# Altium schematic sheet Cap_Sensor_8x8.SchDoc
size A2
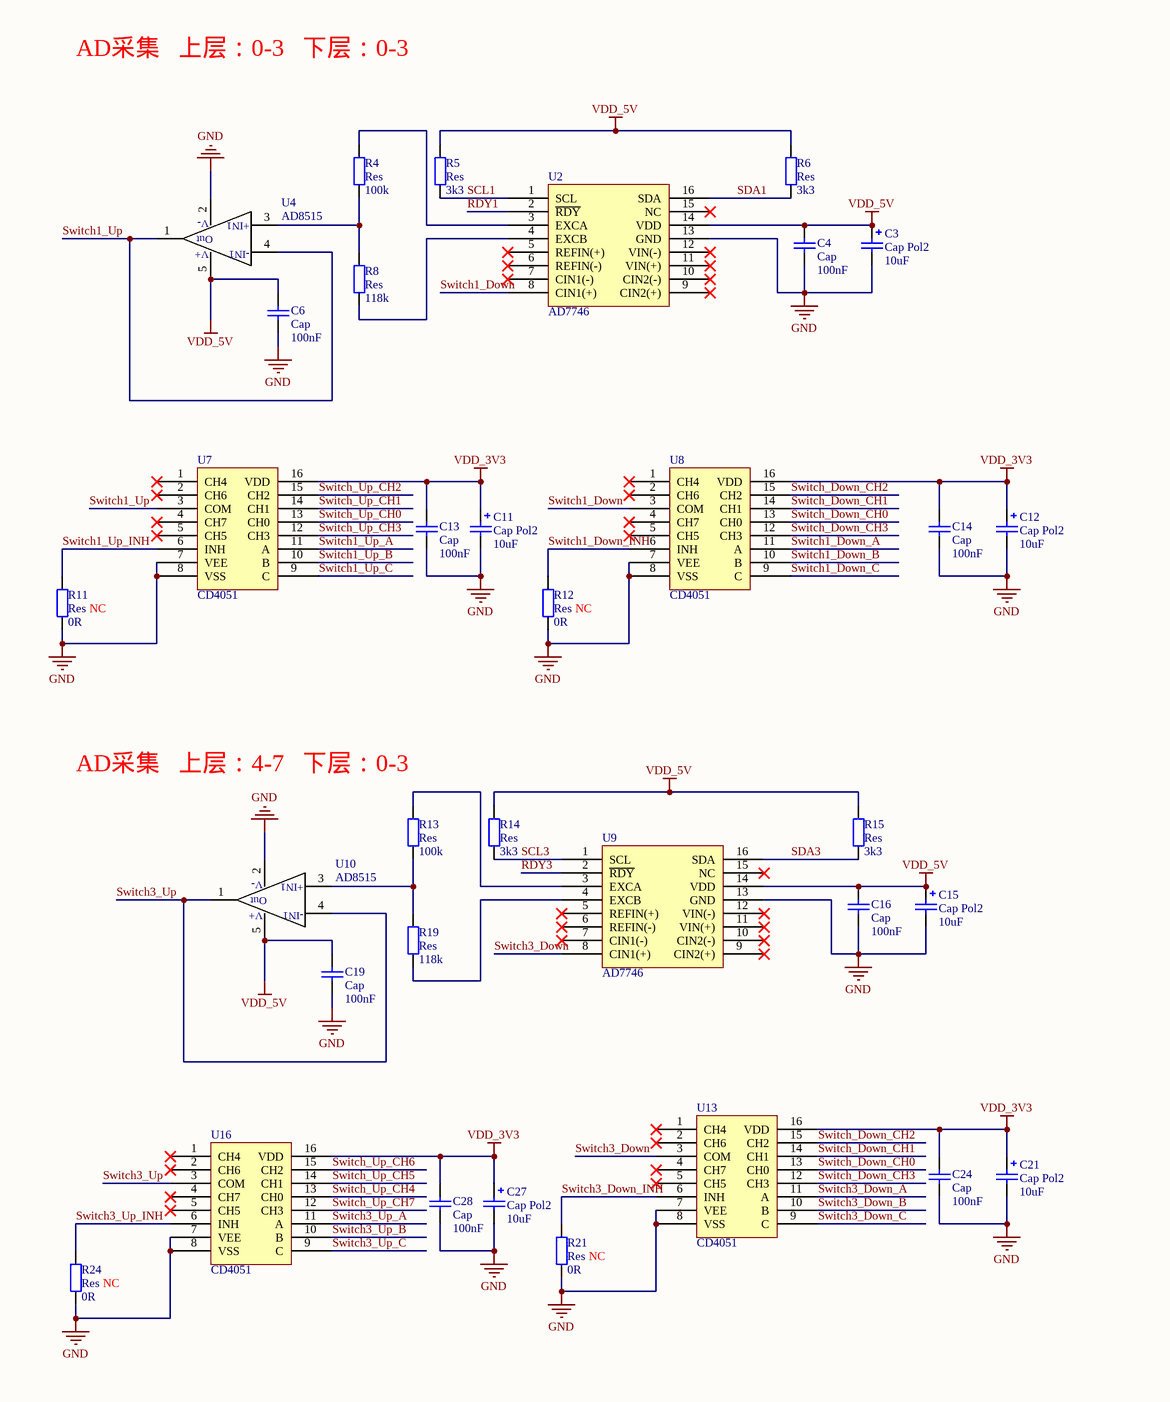
[diagram p0: Cap_Sensor_8x8.SchDoc, left]
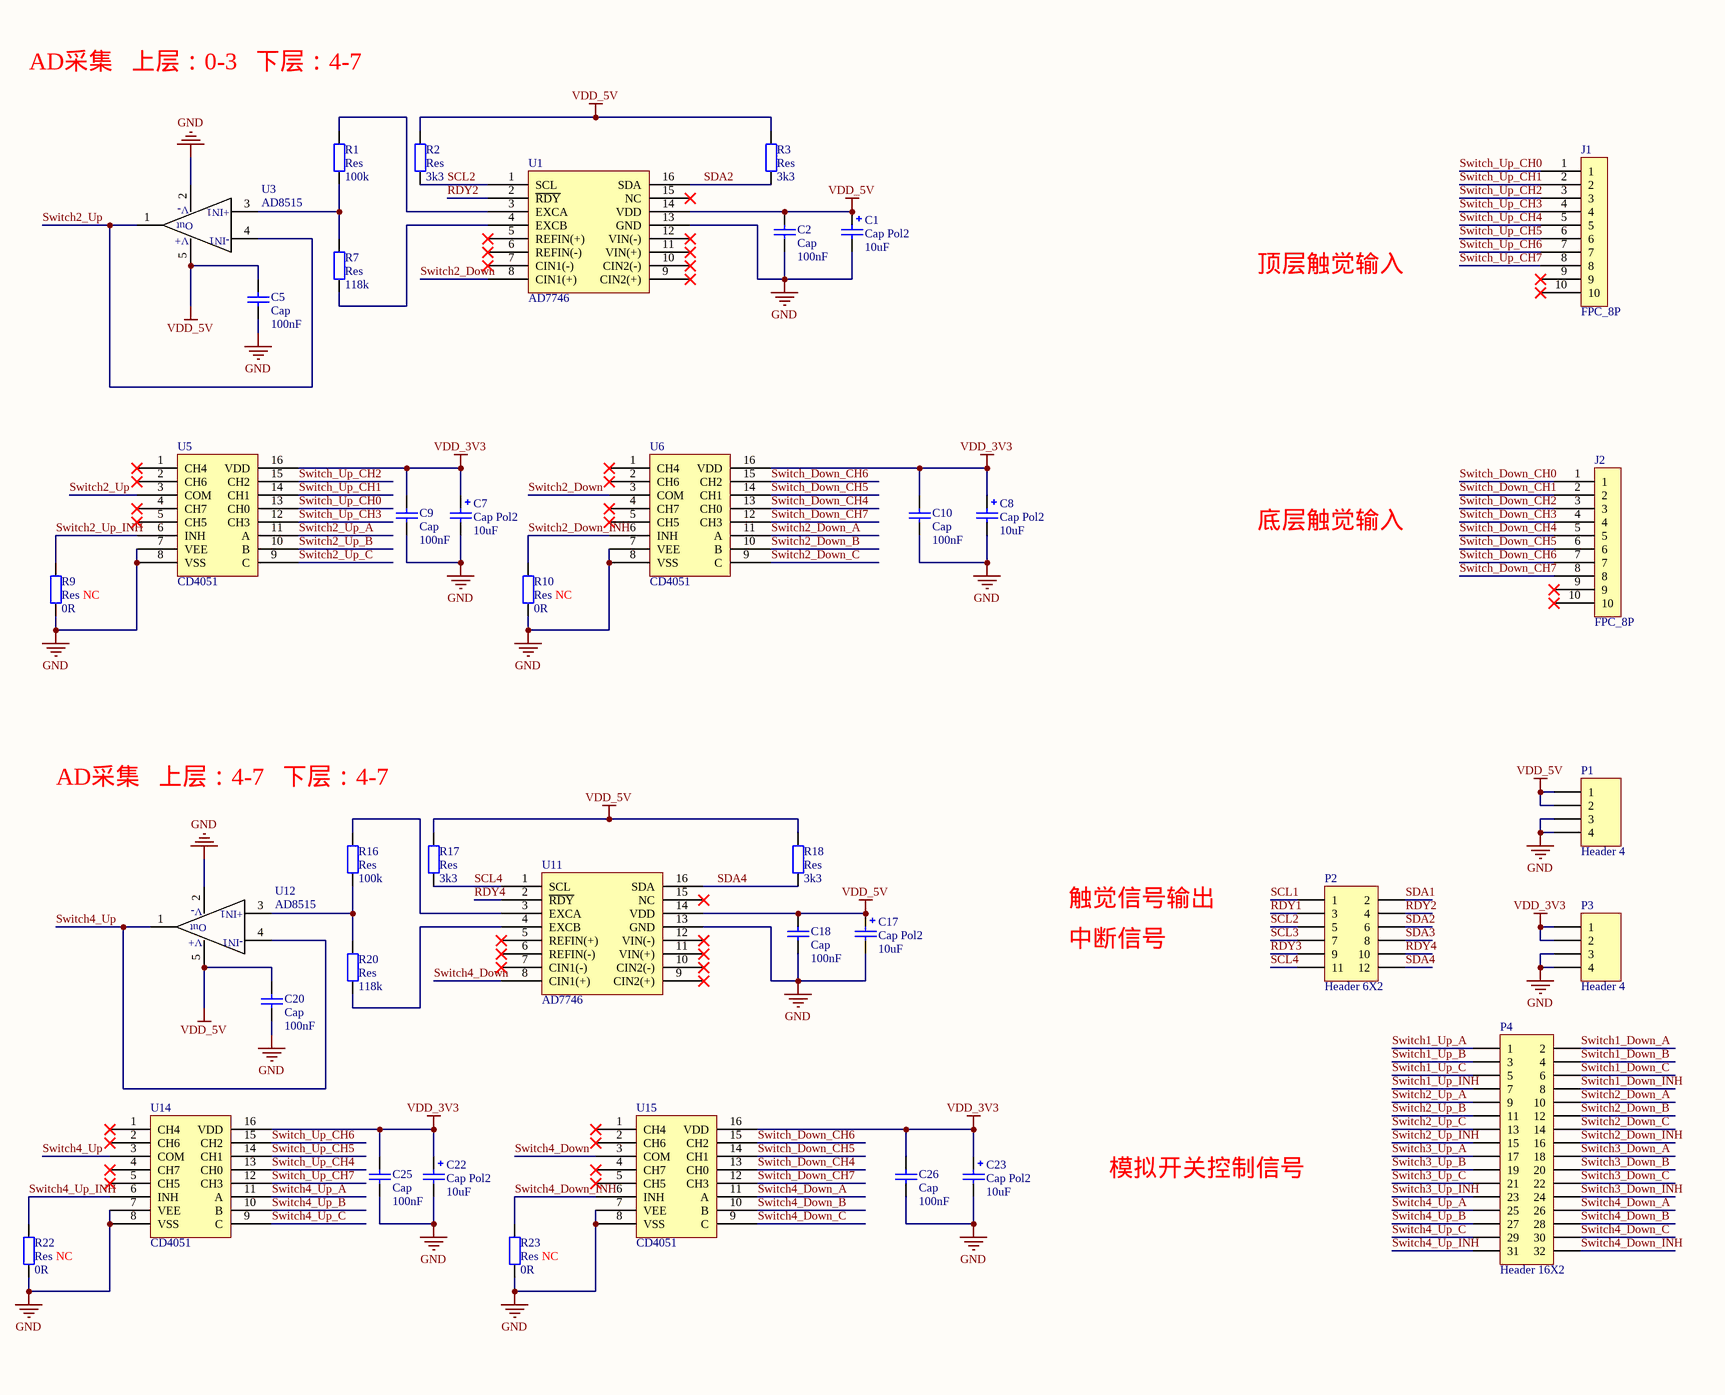
[diagram p1: Cap_Sensor_8x8.SchDoc, right]

## Parts
C1  Cap Pol2  value 10uF  [Cap-TA]
C2  Cap  value 100nF  [0805C]
C3  Cap Pol2  value 10uF  [Cap-TA]
C4  Cap  value 100nF  [0805C]
C5  Cap  value 100nF  [0805C]
C6  Cap  value 100nF  [0805C]
C7  Cap Pol2  value 10uF  [Cap-TA]
C8  Cap Pol2  value 10uF  [Cap-TA]
C9  Cap  value 100nF  [0805C]
C10  Cap  value 100nF  [0805C]
C11  Cap Pol2  value 10uF  [Cap-TA]
C12  Cap Pol2  value 10uF  [Cap-TA]
C13  Cap  value 100nF  [0805C]
C14  Cap  value 100nF  [0805C]
C15  Cap Pol2  value 10uF  [Cap-TA]
C16  Cap  value 100nF  [0805C]
C17  Cap Pol2  value 10uF  [Cap-TA]
C18  Cap  value 100nF  [0805C]
C19  Cap  value 100nF  [0805C]
C20  Cap  value 100nF  [0805C]
C21  Cap Pol2  value 10uF  [Cap-TA]
C22  Cap Pol2  value 10uF  [Cap-TA]
C23  Cap Pol2  value 10uF  [Cap-TA]
C24  Cap  value 100nF  [0805C]
C25  Cap  value 100nF  [0805C]
C26  Cap  value 100nF  [0805C]
C27  Cap Pol2  value 10uF  [Cap-TA]
C28  Cap  value 100nF  [0805C]
J1  FPC_8P  [FPC8-0.5]
J2  FPC_8P  [FPC8-0.5]
P1  Header 4  [HDR1X4]
P2  Header 6X2  [HDR2X6]
P3  Header 4  [HDR1X4]
P4  Header 16X2  [HDR2X16]
R1  Res  value 100k  [0805R]
R2  Res  value 3k3  [0805R]
R3  Res  value 3k3  [0805R]
R4  Res  value 100k  [0805R]
R5  Res  value 3k3  [0805R]
R6  Res  value 3k3  [0805R]
R7  Res  value 118k  [0805R]
R8  Res  value 118k  [0805R]
R9  Res  value 0R  [0805R]
R10  Res  value 0R  [0603R]
R11  Res  value 0R  [0805R]
R12  Res  value 0R  [0603R]
R13  Res  value 100k  [0805R]
R14  Res  value 3k3  [0805R]
R15  Res  value 3k3  [0805R]
R16  Res  value 100k  [0805R]
R17  Res  value 3k3  [0805R]
R18  Res  value 3k3  [0805R]
R19  Res  value 118k  [0805R]
R20  Res  value 118k  [0805R]
R21  Res  value 0R  [0603R]
R22  Res  value 0R  [0805R]
R23  Res  value 0R  [0603R]
R24  Res  value 0R  [0805R]
U1  AD7746  [TSSOP16]
U2  AD7746  [TSSOP16]
U3  AD8515  [sot23-5]
U4  AD8515  [sot23-5]
U5  CD4051  [SO16]
U6  CD4051  [SO16]
U7  CD4051  [SO16]
U8  CD4051  [SO16]
U9  AD7746  [TSSOP16]
U10  AD8515  [sot23-5]
U11  AD7746  [TSSOP16]
U12  AD8515  [sot23-5]
U13  CD4051  [SO16]
U14  CD4051  [SO16]
U15  CD4051  [SO16]
U16  CD4051  [SO16]

## Nets
GND: C1.2 C2.1 C3.2 C4.1 C5.1 C6.1 C7.2 C8.2 C9.1 C10.1 C11.2 C12.2 C13.1 C14.1 C15.2 C16.1 C17.2 C18.1 C19.1 C20.1 C21.2 C22.2 C23.2 C24.1 C25.1 C26.1 C27.2 C28.1 P1.3 P1.4 P3.3 P3.4 R9.1 R10.1 R11.1 R12.1 R21.1 R22.1 R23.1 R24.1 U1.13(GND) U2.13(GND) U3.2(V-) U4.2(V-) U5.7(VEE) U5.8(VSS) U6.7(VEE) U6.8(VSS) U7.7(VEE) U7.8(VSS) U8.7(VEE) U8.8(VSS) U9.13(GND) U10.2(V-) U11.13(GND) U12.2(V-) U13.7(VEE) U13.8(VSS) U14.7(VEE) U14.8(VSS) U15.7(VEE) U15.8(VSS) U16.7(VEE) U16.8(VSS)
VDD_3V3: C7.1 C8.1 C9.2 C10.2 C11.1 C12.1 C13.2 C14.2 C21.1 C22.1 C23.1 C24.2 C25.2 C26.2 C27.1 C28.2 P3.1 P3.2 U5.16(VDD) U6.16(VDD) U7.16(VDD) U8.16(VDD) U13.16(VDD) U14.16(VDD) U15.16(VDD) U16.16(VDD)
VDD_5V: C1.1 C2.2 C3.1 C4.2 C5.2 C6.2 C15.1 C16.2 C17.1 C18.2 C19.2 C20.2 P1.1 P1.2 R2.2 R3.2 R5.2 R6.2 R14.2 R15.2 R17.2 R18.2 U1.14(VDD) U2.14(VDD) U3.5(V+) U4.5(V+) U9.14(VDD) U10.5(V+) U11.14(VDD) U12.5(V+)
RDY1: P2.3 U2.2(~{RDY})
RDY2: P2.4 U1.2(~{RDY})
RDY3: P2.9 U9.2(~{RDY})
RDY4: P2.10 U11.2(~{RDY})
SCL1: P2.1 R5.1 U2.1(SCL)
SCL2: P2.5 R2.1 U1.1(SCL)
SCL3: P2.7 R14.1 U9.1(SCL)
SCL4: P2.11 R17.1 U11.1(SCL)
SDA1: P2.2 R6.1 U2.16(SDA)
SDA2: P2.6 R3.1 U1.16(SDA)
SDA3: P2.8 R15.1 U9.16(SDA)
SDA4: P2.12 R18.1 U11.16(SDA)
Switch1_Down: U2.8(CIN1(+)) U8.3(COM)
Switch1_Down_A: P4.2 U8.11(A)
Switch1_Down_B: P4.4 U8.10(B)
Switch1_Down_C: P4.6 U8.9(C)
Switch1_Down_INH: P4.8 R12.2 U8.6(INH)
Switch1_Up: U4.1(Out1) U4.4(-IN) U7.3(COM)
Switch1_Up_A: P4.1 U7.11(A)
Switch1_Up_B: P4.3 U7.10(B)
Switch1_Up_C: P4.5 U7.9(C)
Switch1_Up_INH: P4.7 R11.2 U7.6(INH)
Switch2_Down: U1.8(CIN1(+)) U6.3(COM)
Switch2_Down_A: P4.10 U6.11(A)
Switch2_Down_B: P4.12 U6.10(B)
Switch2_Down_C: P4.14 U6.9(C)
Switch2_Down_INH: P4.16 R10.2 U6.6(INH)
Switch2_Up: U3.1(Out1) U3.4(-IN) U5.3(COM)
Switch2_Up_A: P4.9 U5.11(A)
Switch2_Up_B: P4.11 U5.10(B)
Switch2_Up_C: P4.13 U5.9(C)
Switch2_Up_INH: P4.15 R9.2 U5.6(INH)
Switch3_Down: U9.8(CIN1(+)) U13.3(COM)
Switch3_Down_A: P4.18 U13.11(A)
Switch3_Down_B: P4.20 U13.10(B)
Switch3_Down_C: P4.22 U13.9(C)
Switch3_Down_INH: P4.24 R21.2 U13.6(INH)
Switch3_Up: U10.1(Out1) U10.4(-IN) U16.3(COM)
Switch3_Up_A: P4.17 U16.11(A)
Switch3_Up_B: P4.19 U16.10(B)
Switch3_Up_C: P4.21 U16.9(C)
Switch3_Up_INH: P4.23 R24.2 U16.6(INH)
Switch4_Down: U11.8(CIN1(+)) U15.3(COM)
Switch4_Down_A: P4.26 U15.11(A)
Switch4_Down_B: P4.28 U15.10(B)
Switch4_Down_C: P4.30 U15.9(C)
Switch4_Down_INH: P4.32 R23.2 U15.6(INH)
Switch4_Up: U12.1(Out1) U12.4(-IN) U14.3(COM)
Switch4_Up_A: P4.25 U14.11(A)
Switch4_Up_B: P4.27 U14.10(B)
Switch4_Up_C: P4.29 U14.9(C)
Switch4_Up_INH: P4.31 R22.2 U14.6(INH)
Switch_Down_CH0: J2.1 U8.13(CH0) U13.13(CH0)
Switch_Down_CH1: J2.2 U8.14(CH1) U13.14(CH1)
Switch_Down_CH2: J2.3 U8.15(CH2) U13.15(CH2)
Switch_Down_CH3: J2.4 U8.12(CH3) U13.12(CH3)
Switch_Down_CH4: J2.5 U6.13(CH0) U15.13(CH0)
Switch_Down_CH5: J2.6 U6.14(CH1) U15.14(CH1)
Switch_Down_CH6: J2.7 U6.15(CH2) U15.15(CH2)
Switch_Down_CH7: J2.8 U6.12(CH3) U15.12(CH3)
Switch_Up_CH0: J1.1 U5.13(CH0) U7.13(CH0)
Switch_Up_CH1: J1.2 U5.14(CH1) U7.14(CH1)
Switch_Up_CH2: J1.3 U5.15(CH2) U7.15(CH2)
Switch_Up_CH3: J1.4 U5.12(CH3) U7.12(CH3)
Switch_Up_CH4: J1.5 U14.13(CH0) U16.13(CH0)
Switch_Up_CH5: J1.6 U14.14(CH1) U16.14(CH1)
Switch_Up_CH6: J1.7 U14.15(CH2) U16.15(CH2)
Switch_Up_CH7: J1.8 U14.12(CH3) U16.12(CH3)
NetR1_1: R1.1 U1.3(EXCA)
NetR1_2: R1.2 R7.1 U3.3(+IN)
NetR4_1: R4.1 U2.3(EXCA)
NetR4_2: R4.2 R8.1 U4.3(+IN)
NetR7_2: R7.2 U1.4(EXCB)
NetR8_2: R8.2 U2.4(EXCB)
NetR13_1: R13.1 U9.3(EXCA)
NetR13_2: R13.2 R19.1 U10.3(+IN)
NetR16_1: R16.1 U11.3(EXCA)
NetR16_2: R16.2 R20.1 U12.3(+IN)
NetR19_2: R19.2 U9.4(EXCB)
NetR20_2: R20.2 U11.4(EXCB)

Not connected (* = marked no-connect by the designer): J1 9* 10*; J2 9* 10*; U1 5(REFIN(+))* 6(REFIN(-))* 7(CIN1(-))* 9(CIN2(+))* 10(CIN2(-))* 11(VIN(+))* 12(VIN(-))* 15(NC)*; U2 5(REFIN(+))* 6(REFIN(-))* 7(CIN1(-))* 9(CIN2(+))* 10(CIN2(-))* 11(VIN(+))* 12(VIN(-))* 15(NC)*; U5 1(CH4)* 2(CH6)* 4(CH7)* 5(CH5)*; U6 1(CH4)* 2(CH6)* 4(CH7)* 5(CH5)*; U7 1(CH4)* 2(CH6)* 4(CH7)* 5(CH5)*; U8 1(CH4)* 2(CH6)* 4(CH7)* 5(CH5)*; U9 5(REFIN(+))* 6(REFIN(-))* 7(CIN1(-))* 9(CIN2(+))* 10(CIN2(-))* 11(VIN(+))* 12(VIN(-))* 15(NC)*; U11 5(REFIN(+))* 6(REFIN(-))* 7(CIN1(-))* 9(CIN2(+))* 10(CIN2(-))* 11(VIN(+))* 12(VIN(-))* 15(NC)*; U13 1(CH4)* 2(CH6)* 4(CH7)* 5(CH5)*; U14 1(CH4)* 2(CH6)* 4(CH7)* 5(CH5)*; U15 1(CH4)* 2(CH6)* 4(CH7)* 5(CH5)*; U16 1(CH4)* 2(CH6)* 4(CH7)* 5(CH5)*

## Notes on the sheet
- AD采集   上层：0-3   下层：0-3
- AD采集   上层：0-3   下层：4-7
- 顶层触觉输入
- 底层触觉输入
- (near R11) NC
- (near R12) NC
- (near R9) NC
- (near R10) NC
- AD采集   上层：4-7   下层：0-3
- AD采集   上层：4-7   下层：4-7
- 触觉信号输出
- 中断信号
- 模拟开关控制信号
- (near R21) NC
- (near R22) NC
- (near R23) NC
- (near R24) NC
- (in symbol AD8515) +IN1; Out; -IN1

## Library data of the parts
C1 C3 C7 C8 C11 C12 C15 C17 C21-C23 C27 = Cap Pol2: Polarized Capacitor (Axial); Published: 8-Jun-2000; LatestRevisionDate: 17-Jul-2002; LatestRevisionNote: Re-released for DXP Platform.; PackageReference: POLAR0.8; Publisher: Altium Limited; PackageDescription: Polarized Capacitor; 2 Leads
C2 C4-C6 C9 C10 C13 C14 C16 C18-C20 C24-C26 C28 = Cap: Capacitor; Published: 8-Jun-2000; LatestRevisionDate: 17-Jul-2002; LatestRevisionNote: Re-released for DXP Platform.; PackageReference: RAD-0.3; Publisher: Altium Limited; PackageDescription: Radial Cap, Thru-Hole; 2 Leads; 0.3 in Pin Spacing
P1 P3 = Header 4: Header, 4-Pin; LatestRevisionDate: 17-Jul-2002; LatestRevisionNote: Re-released for DXP Platform.; Publisher: Altium Limited
P2 = Header 6X2: Header, 6-Pin, Dual row; LatestRevisionDate: 17-Jul-2002; LatestRevisionNote: Re-released for DXP Platform.; Publisher: Altium Limited
P4 = Header 16X2: Header, 16-Pin, Dual row; LatestRevisionDate: 17-Jul-2002; LatestRevisionNote: Re-released for DXP Platform.; Publisher: Altium Limited
R1-R24 = Res: Resistor; Published: 8-Jun-2000; LatestRevisionDate: 17-Jul-2002; LatestRevisionNote: Re-released for DXP Platform.; PackageReference: AXIAL-0.4; Publisher: Altium Limited; PackageDescription: Axial Device, Thru-Hole; 2 Leads; 0.4 in Pin Spacing